# EAGLE design led_fading_circuit (EAGLE 6.4)
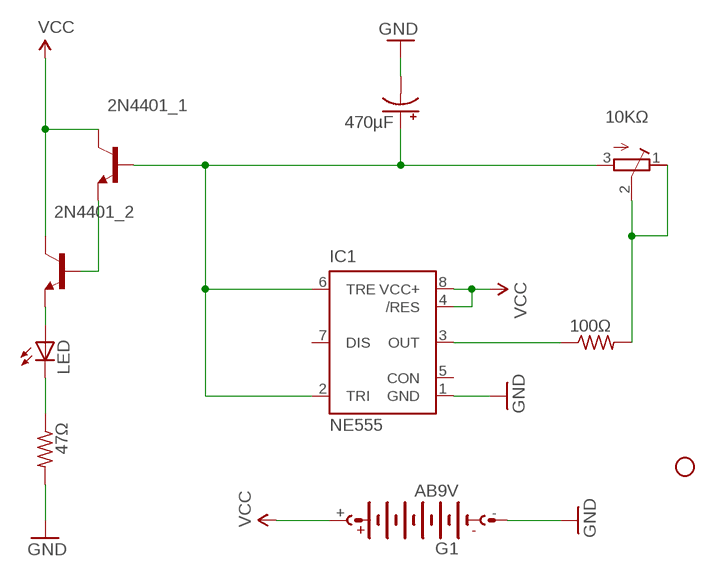
[diagram p0: schematic, sheet 1]

## Parts
2N4401_1  -NPN-TO92-EBC  [TO92-EBC]
2N4401_2  -NPN-TO92-EBC  [TO92-EBC]
10KΩ  R-TRIMMT93XA  [RTRIMT93XA]
47Ω  R-US_0204/7  [0204/7]
100Ω  R-US_0207/10  [0207/10]
470µF  CPOL-USE2.5-6  [E2,5-6]
G1  AB9V  [AB9V]
IC1  NE555  [DIL-08]
LED  LED5MM  [LED5MM]
STANDOFF1  STAND-OFF  [STAND-OFF]

## Nets
GND: 47Ω.2 470µF.- G1.- IC1.1(GND)
N$1: 2N4401_1.E 2N4401_2.B
N$2: 2N4401_2.E LED.A
N$3: 47Ω.1 LED.K(C)
N$4: 2N4401_1.B 10KΩ.3(E) 470µF.+ IC1.2(TRI) IC1.6(TRE)
N$5: 100Ω.1 IC1.3(OUT)
N$6: 10KΩ.1(A) 10KΩ.2(S) 100Ω.2
VCC: 2N4401_1.C 2N4401_2.C G1.+ IC1.4(/RES) IC1.8(VCC+)
Unconnected: IC1.5(CON) IC1.7(DIS)

## Library data of the parts
2N4401_1 2N4401_2 = transistor:*-NPN-: NPN Transistror BF959 corrected 2008.03.06
10KΩ = resistor:R-TRIMM: Trimm resistor
47Ω 100Ω = rcl:R-US_: RESISTOR, American symbol
470µF = rcl:CPOL-US: POLARIZED CAPACITOR, American symbol
G1 = battery:AB9V: 9-V BATTERY CLIP
IC1 = st-microelectronics:NE555: General purpose bipolar Timer; MF: Arrow Electronics; MPN: NE555N; OC_FARNELL: 1467742; OC_NEWARK: 89K1486
LED = led:LED: LED OSRAM: - CHIPLED LG R971, LG N971, LY N971, LG Q971, LY Q971, LO R971, LY R971 LH N974, LH R974 LS Q976, LO Q976, LY Q976 LO Q996 - Hyper CHIPLED LW Q18S LB Q993, LB Q99A, LB R99A - SideLED LS A670, LO A670, LY A670, LG A670, LP A670 LB A673, LV A673, LT A673, LW A673 LH A674 LY A675 LS A676, LA A676, LO A676, LY A676, LW A676 LS A679, LY A679, LG A679 - Hyper Micro SIDELED® LS Y876, LA Y876, LO Y876, LY Y876 LT Y87S - SmartLED LW L88C, LW L88S LB L89C, LB L89S, LG L890 LS L89K, LO L89K, LY L89K LS L896, LA L896, LO L896, LY L896 - TOPLED LS T670, LO T670, LY T670, LG T670, LP T670 LSG T670, LSP T670, LSY T670, LOP T670, LYG T670 LG T671, LOG T671, LSG T671 LB T673, LV T673, LT T673, LW T673 LH T674 LS T676, LA T676, LO T676, LY T676, LB T676, LH T676, LSB T676, LW T676 LB T67C, LV T67C, LT T67C, LS T67K, LO T67K, LY T67K, LW E67C LS E67B, LA E67B, LO E67B, LY E67B, LB E67C, LV E67C, LT E67C LW T67C LS T679, LY T679, LG T679 LS T770, LO T770, LY T770, LG T770, LP T770 LB T773, LV T773, LT T773, LW T773 LH T774 LS E675, LA E675, LY E675, LS T675 LS T776, LA T776, LO T776, LY T776, LB T776 LHGB T686 LT T68C, LB T68C - Hyper Mini TOPLED® LB M676 - Mini TOPLED Santana® LG M470 LS M47K, LO M47K, LY M47K Source: http://www.osram.convergy.de LUXEON: - LUMILED® LXK2-PW12-R00, LXK2-PW12-S00, LXK2-PW14-U00, LXK2-PW14-V00 LXK2-PM12-R00, LXK2-PM12-S00, LXK2-PM14-U00 LXK2-PE12-Q00, LXK2-PE12-R00, LXK2-PE12-S00, LXK2-PE14-T00, LXK2-PE14-U00 LXK2-PB12-K00, LXK2-PB12-L00, LXK2-PB12-M00, LXK2-PB14-N00, LXK2-PB14-P00, LXK2-PB14-Q00 LXK2-PR12-L00, LXK2-PR12-M00, LXK2-PR14-Q00, LXK2-PR14-R00 LXK2-PD12-Q00, LXK2-PD12-R00, LXK2-PD12-S00 LXK2-PH12-R00, LXK2-PH12-S00 LXK2-PL12-P00, LXK2-PL12-Q00, LXK2-PL12-R00 Source: www.luxeon.com KINGBRIGHT: KA-3528ASYC Source: www.kingbright.com
STANDOFF1 = SparkFun-Electromechanical:STAND-OFF: #4 Stand Off This is the mechanical footprint for a #4 phillips button head screw. Use the keepout ring to avoid running the screw head into surrounding components. SKU : PRT-00447

## Board
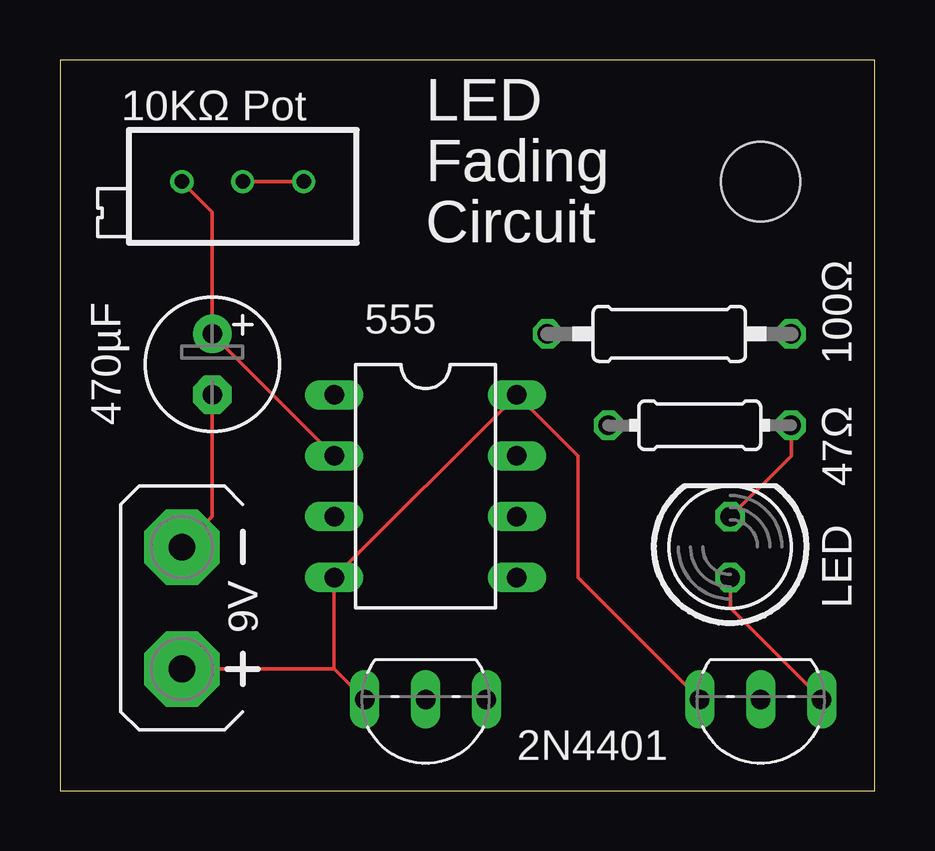
[diagram p1: board, top side]
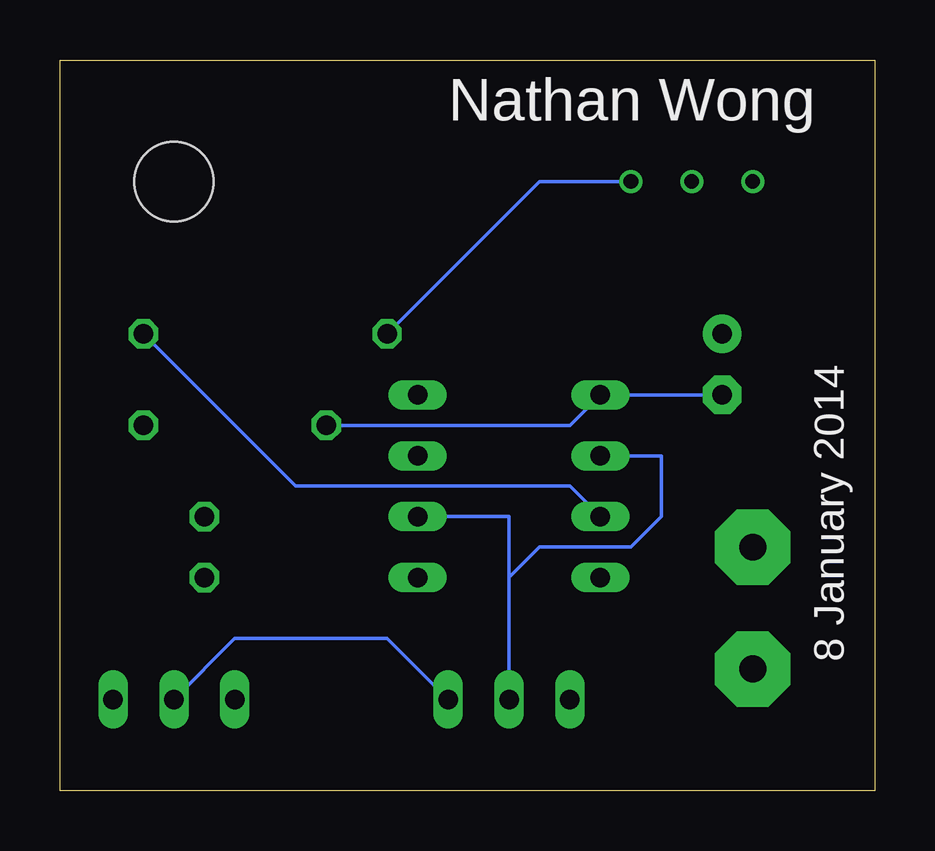
[diagram p2: board, bottom side, seen from below]

Size 33.96 x 30.47 mm. Coordinates in mm from the lower left corner, seen from the top.
Outline: 0,0 33.96,0 33.96,30.47 0,30.47 0,0
Copper layers (1*16): Top 0.0356mm / dielectric 1.5011mm / Bottom 0.0356mm
Design rules "LaenPCBOrder": minimum track width 6mil, minimum drill 13mil, track to track 6mil, track to pad 6mil, pad to pad 6mil, via to via 6mil, smd to smd 6mil, copper to edge 15mil, drill to drill 6mil, minimum pad ring 7mil, minimum via ring 7mil, stop-mask expansion 3mil, vias tented up to drill 0mil, thermal gap 10mil

### Footprints (pad centres in the part's own frame; a part is rotated, then mirrored left to right if it is on the bottom)
TO92-EBC = drill 0.813 long: B 0,-1.27; C 2.54,-1.27; E -2.54,-1.27
RTRIMT93XA = drill 0.61: 1 0,-2.54; 2 0,0; 3 0,2.54
0204/7 = drill 0.813 octagon: 1 -3.81,0; 2 3.81,0
0207/10 = drill 0.813 octagon: 1 -5.08,0; 2 5.08,0
E2,5-6 = drill 0.813 pad 1.6: + -1.27,0 | drill 0.813 pad 1.6 octagon: - 1.27,0
AB9V = drill 1.118 pad 3.15 octagon: + 0,2.54; - 0,-2.54
DIL-08 = drill 0.813 long: 1 -3.81,-3.81; 2 -1.27,-3.81; 3 1.27,-3.81; 4 3.81,-3.81; 5 3.81,3.81; 6 1.27,3.81; 7 -1.27,3.81; 8 -3.81,3.81
LED5MM = drill 0.813 octagon: A -1.27,0; K 1.27,0
STAND-OFF = hole 3.302: 0,0

### Placement (x,y rotation side)
2N4401_1  15.24,2.54 180 top
2N4401_2  29.21,2.54 180 top
10KΩ  7.62,25.4 90 top
47Ω  26.67,15.24 180 top
100Ω  25.4,19.05 180 top
470µF  6.35,17.78 270 top
G1  5.08,7.62 180 top
IC1  15.24,12.7 270 top
LED  27.94,10.16 90 top
STANDOFF1  29.21,25.4 0 top

### Tracks (layer width: path | path; a pad name or v marks a point on that pad's centre or on a via)
GND
  Top 0.152: G1.- 6.35,11.43 470µF.-
  Bottom 0.152: 470µF.- IC1.1 12.7,15.24 47Ω.2
N$1
  Bottom 0.152: 2N4401_1.E 20.32,6.35 26.67,6.35 2N4401_2.B
N$2
  Top 0.152: 2N4401_2.E 27.94,7.62 LED.A
N$3
  Top 0.152: LED.K 30.48,13.97 47Ω.1
N$4
  Top 0.152: 10KΩ.3 6.35,24.13 470µF.+ IC1.2
  Bottom 0.152: 15.24,8.89 15.24,11.43 IC1.6 | 15.24,8.89 2N4401_1.B | 15.24,8.89 13.97,10.16 10.16,10.16 8.89,11.43 8.89,13.97 IC1.2
N$5
  Bottom 0.152: IC1.3 12.7,12.7 24.13,12.7 100Ω.1
N$6
  Top 0.152: 10KΩ.1 10KΩ.2
  Bottom 0.152: 100Ω.2 13.97,25.4 10KΩ.1
VCC
  Top 0.152: 11.43,5.08 2N4401_1.C | 11.43,5.08 IC1.4 IC1.8 21.59,13.97 21.59,8.89 2N4401_2.C | G1.+ 11.43,5.08

### Text on the board
tPlace: 10KΩ Pot | LED | Fading | Circuit | 555 | 100Ω | 470µF | 47Ω | LED | 2N4401
bPlace: Nathan Wong | 8 January 2014